# EAGLE schematic MCU_RTC_MUX_INTEGRATED_051215_R1 (EAGLE 7.1.0)
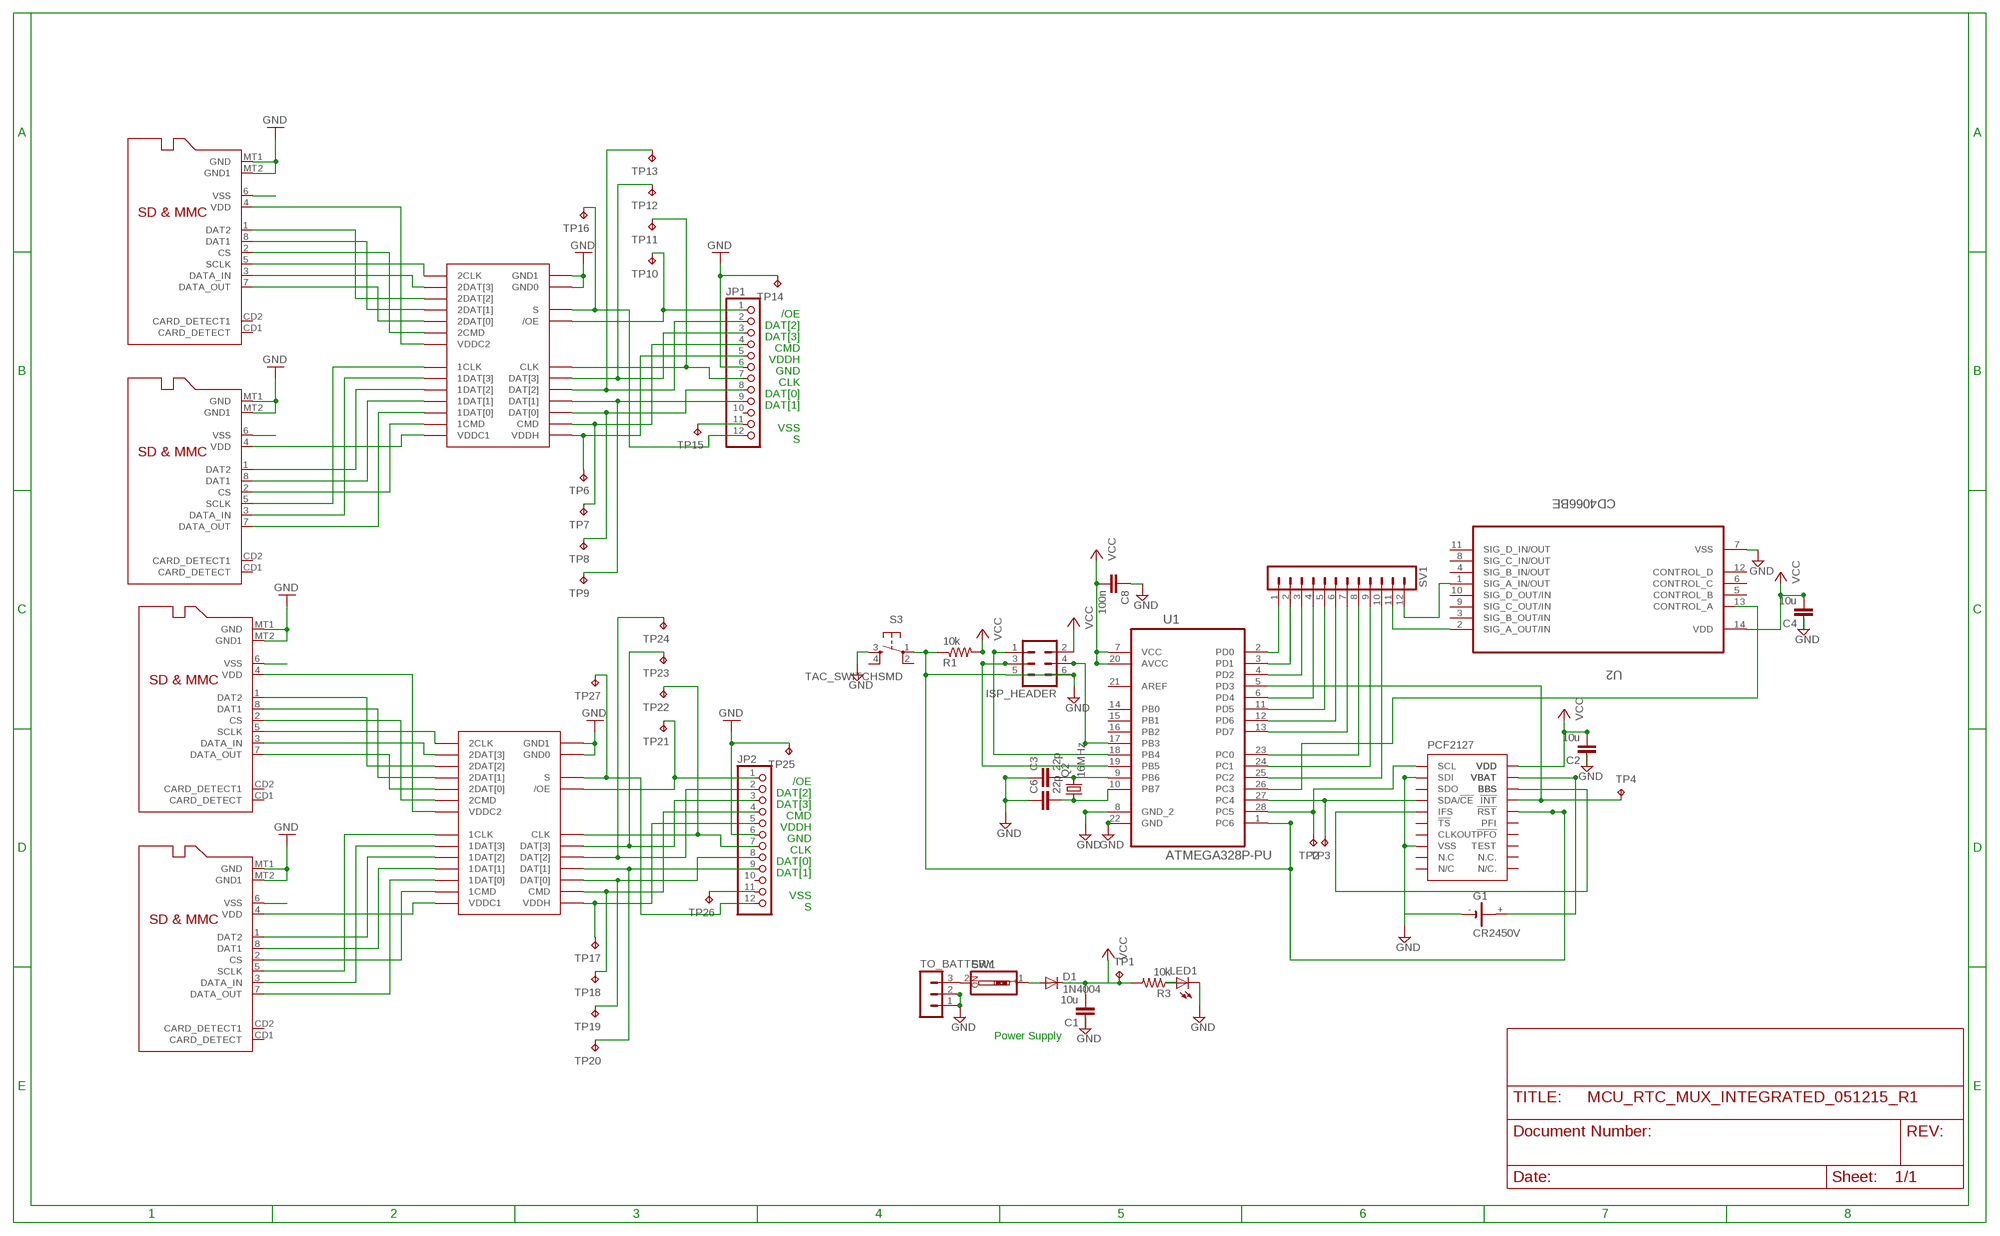
[diagram p0: schematic, sheet 1]

## Parts
C1  10u  C-EUC0805  [C0805]
C2  10u  C-EUC0805  [C0805]
C3  22p  C-EUC0805  [C0805]
C4  10u  C-EUC0805  [C0805]
C6  22p  C-EUC0805  [C0805]
C8  100n  C-EUC0805  [C0805]
D1  1N4004  [DO41-10]
G1  CR2450V  [CR2450V]
IC3  PCF2127  [DIL18]
ISP_HEADER  MA03-2  [MA03-2]
JP1  PINHD-1X12  [1X12]
JP2  PINHD-1X12  [1X12]
LED1  LEDCHIPLED_0805  [CHIPLED_0805]
Q2  16MHz  CRYSTALHC49S  [HC49/S]
R1  10k  R-US_R0805  [R0805]
R3  10k  R-US_R0805  [R0805]
S3  TAC_SWITCHSMD  [TACTILE-SWITCH-SMD]
SV1  MA12-1W  [MA12-1W]
SW1  SW_DIP-1  [EDG-01]
TO_BATTERY  MA03-1  [MA03-1]
TP1  TPB1,27  [B1,27]
TP2  TPB1,27  [B1,27]
TP3  TPB1,27  [B1,27]
TP4  TPB1,27  [B1,27]
TP6  TPTP20R  [TP20R]
TP7  TPTP20R  [TP20R]
TP8  TPTP20R  [TP20R]
TP9  TPTP20R  [TP20R]
TP10  TPTP20R  [TP20R]
TP11  TPTP20R  [TP20R]
TP12  TPTP20R  [TP20R]
TP13  TPTP20R  [TP20R]
TP14  TPTP20R  [TP20R]
TP15  TPTP20R  [TP20R]
TP16  TPTP20R  [TP20R]
TP17  TPTP20R  [TP20R]
TP18  TPTP20R  [TP20R]
TP19  TPTP20R  [TP20R]
TP20  TPTP20R  [TP20R]
TP21  TPTP20R  [TP20R]
TP22  TPTP20R  [TP20R]
TP23  TPTP20R  [TP20R]
TP24  TPTP20R  [TP20R]
TP25  TPTP20R  [TP20R]
TP26  TPTP20R  [TP20R]
TP27  TPTP20R  [TP20R]
U1  ATMEGA328P-PU  [DIP254P762X457-28]
U2  CD4066BE  [DIP254P762X508-14]
U$1  FSSD06  [MLP-24]
U$2  MICROSD  [MICROSD]
U$3  MICROSD  [MICROSD]
U$4  FSSD06  [MLP-24]
U$5  MICROSD  [MICROSD]
U$6  MICROSD  [MICROSD]

## Nets
/OE: JP1.1 TP10.TP U$1./OE
/OE1: JP2.1 TP21.TP U$4./OE
CLK: JP1.7 TP11.TP U$1.CLK
CLK1: JP2.7 TP22.TP U$4.CLK
CMD: JP1.4 TP7.TP U$1.CMD
CMD1: JP2.4 TP18.TP U$4.CMD
DAT0: JP1.8 TP8.TP U$1.DAT[0]
DAT1: JP1.9 TP9.TP U$1.DAT[1]
DAT2: JP1.2 TP13.TP U$1.DAT[2]
DAT3: JP1.3 TP12.TP U$1.DAT[3]
DAT4: JP2.2 TP24.TP U$4.DAT[2]
DAT5: JP2.3 TP23.TP U$4.DAT[3]
DAT6: JP2.8 TP19.TP U$4.DAT[0]
DAT7: JP2.9 TP20.TP U$4.DAT[1]
GND: C1.1 C2.1 C3.1 C4.1 C6.1 C8.1 G1.- IC3.2(SDI) IC3.8(VSS) IC3.14(!RST) ISP_HEADER.5 ISP_HEADER.6 JP1.6 JP2.6 LED1.C R1.1 S3.1 S3.3 TO_BATTERY.1 TO_BATTERY.2 TP3.TP TP14.TP TP25.TP U1.1(PC6) U1.8(GND_2) U1.22(GND) U1.27(PC4) U2.7(VSS) U$1.GND0 U$1.GND1 U$2.MT1(GND) U$2.MT2(GND1) U$3.MT1(GND) U$3.MT2(GND1) U$4.GND0 U$4.GND1 U$5.MT1(GND) U$5.MT2(GND1) U$6.MT1(GND) U$6.MT2(GND1)
N$1: U$4.1CMD U$5.2(CS)
N$2: LED1.A R3.1
N$3: D1.A SW1.1
N$4: IC3.4(SDA/!CE)
N$5: C1.2 D1.C R3.2 TP1.TP
N$6: SV1.1 U1.2(PD0)
N$7: SV1.2 U1.3(PD1)
N$8: C3.2 Q2.2 U1.9(PB6)
N$9: U2.14(VDD)
N$10: C6.2 Q2.1 U1.10(PB7)
N$11: ISP_HEADER.3 U1.19(PB5)
N$12: SV1.3 U1.4(PD2)
N$13: SV1.4 U1.6(PD4)
N$14: IC3.1(SCL) TP2.TP U1.28(PC5)
N$15: G1.+ IC3.17(VBAT)
N$16: SV1.5 U1.11(PD5)
N$17: SV1.6 U1.12(PD6)
N$18: SV1.7 U1.13(PD7)
N$19: SV1.8 U1.23(PC0)
N$20: SW1.2 TO_BATTERY.3
N$21: IC3.5(IFS) IC3.16(BBS)
N$22: SV1.9 U1.24(PC1)
N$23: SV1.10 U1.25(PC2)
N$24: U1.26(PC3)
N$25: IC3.15(!INT) TP4.TP U1.5(PD3)
N$26: SV1.11 U2.2(SIG_A_OUT/IN)
N$27: SV1.12 U2.1(SIG_A_IN/OUT)
N$37: U$1.1CMD U$2.2(CS)
N$38: U$1.1DAT[0] U$2.7(DATA_OUT)
N$39: U$1.1DAT[1] U$2.8(DAT1)
N$40: U$1.1DAT[2] U$2.1(DAT2)
N$41: U$1.1DAT[3] U$2.3(DATA_IN)
N$42: U$1.1CLK U$2.5(SCLK)
N$43: U$1.2CMD U$3.2(CS)
N$44: U$1.2DAT[0] U$3.7(DATA_OUT)
N$45: U$1.2DAT[1] U$3.8(DAT1)
N$46: U$1.2DAT[2] U$3.1(DAT2)
N$47: U$1.2DAT[3] U$3.3(DATA_IN)
N$48: U$1.2CLCK(2CLK) U$3.5(SCLK)
N$49: U$4.1DAT[0] U$5.7(DATA_OUT)
N$50: U$4.1DAT[1] U$5.8(DAT1)
N$51: U$4.1DAT[2] U$5.1(DAT2)
N$52: U$4.1DAT[3] U$5.3(DATA_IN)
N$53: U$4.1CLK U$5.5(SCLK)
N$54: U$4.2CMD U$6.2(CS)
N$55: U$4.2DAT[0] U$6.7(DATA_OUT)
N$56: U$4.2DAT[1] U$6.8(DAT1)
N$57: U$4.2DAT[2] U$6.1(DAT2)
N$58: U$4.2DAT[3] U$6.3(DATA_IN)
N$59: U$4.2CLCK(2CLK) U$6.5(SCLK)
N$60: ISP_HEADER.1 U1.18(PB4)
N$61: ISP_HEADER.4 U1.17(PB3)
S: JP1.12 TP16.TP U$1.S
S1: JP2.12 TP27.TP U$4.S
VCC: C2.2 C4.2 C8.2 IC3.18(VDD) ISP_HEADER.2 R1.2 U1.7(VCC) U1.20(AVCC)
VDDC1: U$1.VDDC1 U$2.4(VDD) U$4.VDDC1 U$5.4(VDD)
VDDC2: U$1.VDDC2 U$3.4(VDD) U$4.VDDC2 U$6.4(VDD)
VDDH: JP1.5 TP6.TP U$1.VDDH
VDDH1: JP2.5 TP17.TP U$4.VDDH
VSS: JP1.11 JP2.11 TP15.TP TP26.TP U$2.6(VSS) U$3.6(VSS) U$5.6(VSS) U$6.6(VSS)
Unconnected: G1.+@1(+) IC3.3(SDO) IC3.6(!TS) IC3.7(CLKOUT) IC3.10(N.C.) IC3.11(TEST) IC3.12(!PFO) IC3.13(PFI) IC3.19(N/C.) JP1.10 JP2.10 S3.2 S3.4 U1.14(PB0) U1.15(PB1) U1.16(PB2) U1.21(AREF) U2.3(SIG_B_OUT/IN) U2.4(SIG_B_IN/OUT) U2.5(CONTROL_B) U2.6(CONTROL_C) U2.8(SIG_C_IN/OUT) U2.9(SIG_C_OUT/IN) U2.10(SIG_D_OUT/IN) U2.11(SIG_D_IN/OUT) U2.12(CONTROL_D) U2.13(CONTROL_A) U$2.CD1(CARD_DETECT) U$2.CD2(CARD_DETECT1) U$3.CD1(CARD_DETECT) U$3.CD2(CARD_DETECT1) U$5.CD1(CARD_DETECT) U$5.CD2(CARD_DETECT1) U$6.CD1(CARD_DETECT) U$6.CD2(CARD_DETECT1)

## Notes on the sheet
- /OE
- DAT[2]
- DAT[3]
- CMD
- VDDH
- GND
- CLK
- DAT[0]
- DAT[1]
- VSS
- S
- /OE
- DAT[2]
- DAT[3]
- CMD
- VDDH
- GND
- CLK
- DAT[0]
- DAT[1]
- VSS
- S
- Power Supply

## Power pins joined to a net without a drawn wire
N.C: IC3.9(N.C)
N/C: IC3.20(N/C)

## Library data of the parts
C1-C4 C6 C8 = rcl:C-EU: CAPACITOR, European symbol
D1 = diode:1N4004: DIODE general purpose rectifier, 1 A
G1 = battery:CR2450V: LI BATTERY Varta
IC3 = pcf2127:PCF2127: Real Time Clock PCF2127AT
ISP_HEADER = con-lstb:MA03-2: PIN HEADER; OC_FARNELL: unknown; OC_NEWARK: unknown
JP1 JP2 = adafruit:PINHD-1X12: PIN HEADER
LED1 = led:LED: LED OSRAM: - CHIPLED LG R971, LG N971, LY N971, LG Q971, LY Q971, LO R971, LY R971 LH N974, LH R974 LS Q976, LO Q976, LY Q976 LO Q996 - Hyper CHIPLED LW Q18S LB Q993, LB Q99A, LB R99A - SideLED LS A670, LO A670, LY A670, LG A670, LP A670 LB A673, LV A673, LT A673, LW A673 LH A674 LY A675 LS A676, LA A676, LO A676, LY A676, LW A676 LS A679, LY A679, LG A679 - Hyper Micro SIDELED® LS Y876, LA Y876, LO Y876, LY Y876 LT Y87S - SmartLED LW L88C, LW L88S LB L89C, LB L89S, LG L890 LS L89K, LO L89K, LY L89K LS L896, LA L896, LO L896, LY L896 - TOPLED LS T670, LO T670, LY T670, LG T670, LP T670 LSG T670, LSP T670, LSY T670, LOP T670, LYG T670 LG T671, LOG T671, LSG T671 LB T673, LV T673, LT T673, LW T673 LH T674 LS T676, LA T676, LO T676, LY T676, LB T676, LH T676, LSB T676, LW T676 LB T67C, LV T67C, LT T67C, LS T67K, LO T67K, LY T67K, LW E67C LS E67B, LA E67B, LO E67B, LY E67B, LB E67C, LV E67C, LT E67C LW T67C LS T679, LY T679, LG T679 LS T770, LO T770, LY T770, LG T770, LP T770 LB T773, LV T773, LT T773, LW T773 LH T774 LS E675, LA E675, LY E675, LS T675 LS T776, LA T776, LO T776, LY T776, LB T776 LHGB T686 LT T68C, LB T68C - Hyper Mini TOPLED® LB M676 - Mini TOPLED Santana® LG M470 LS M47K, LO M47K, LY M47K Source: http://www.osram.convergy.de LUXEON: - LUMILED® LXK2-PW12-R00, LXK2-PW12-S00, LXK2-PW14-U00, LXK2-PW14-V00 LXK2-PM12-R00, LXK2-PM12-S00, LXK2-PM14-U00 LXK2-PE12-Q00, LXK2-PE12-R00, LXK2-PE12-S00, LXK2-PE14-T00, LXK2-PE14-U00 LXK2-PB12-K00, LXK2-PB12-L00, LXK2-PB12-M00, LXK2-PB14-N00, LXK2-PB14-P00, LXK2-PB14-Q00 LXK2-PR12-L00, LXK2-PR12-M00, LXK2-PR14-Q00, LXK2-PR14-R00 LXK2-PD12-Q00, LXK2-PD12-R00, LXK2-PD12-S00 LXK2-PH12-R00, LXK2-PH12-S00 LXK2-PL12-P00, LXK2-PL12-Q00, LXK2-PL12-R00 Source: www.luxeon.com KINGBRIGHT: KA-3528ASYC Source: www.kingbright.com
Q2 = crystal:CRYSTAL: CRYSTAL; OC_FARNELL: 1667008; OC_NEWARK: unknown
R1 R3 = rcl:R-US_: RESISTOR, American symbol
S3 = SparkFun-Electromechanical:TAC_SWITCH: Momentary Switch Button commonly used for reset or general input. Spark Fun Electronics SKU : COM-00097 SMT- SWCH-08247; PROD_ID: SWCH-08247
SV1 = con-lstb:MA12-1W: PIN HEADER; OC_FARNELL: unknown; OC_NEWARK: unknown
SW1 = special:SW_DIP-1: DIP SWITCH
TO_BATTERY = con-lstb:MA03-1: PIN HEADER; OC_FARNELL: unknown; OC_NEWARK: unknown
TP1-TP4 TP6-TP27 = testpad:TP: Test pad
U1 = Atmel_By_element14_Batch_1-00:ATMEGA328P-PU: 8-bit Microcontroller with In-System Programmable Flash; MPN: ATMEGA328P-PU; OC_FARNELL: 1715487; OC_NEWARK: 15R0268; PACKAGE: PDIP-28; SUPPLIER: Atmel
U2 = Texas Instruments_By_element14_Batch_1:CD4066BE: CMOS Quad Bilateral Switch; MPN: CD4066BE; OC_FARNELL: 1106112; OC_NEWARK: 60K5124; PACKAGE: PDIP-14; SUPPLIER: Texas Instruments
U$1 U$4 = FSSD06_MLP24a:FSSD06
U$2 U$3 U$5 U$6 = adafruit:MICROSD: Micro-SD / Transflash card holder with SPI pinout For the 3M # 2908-05WB-MG and/or 4UCON #19656 push-push type